# EasyEDA Pro project wireless charger controller.eprj, schematic Schematic3
Board Name: 3代; Create Date: 2025-03-22; Page Name: P1; Project Name: wireless charger controller; Schematic Name: Schematic3; Update Date: 2025-05-02; Company: 嘉立创EDA; Page Size: A4; Version: V1.0
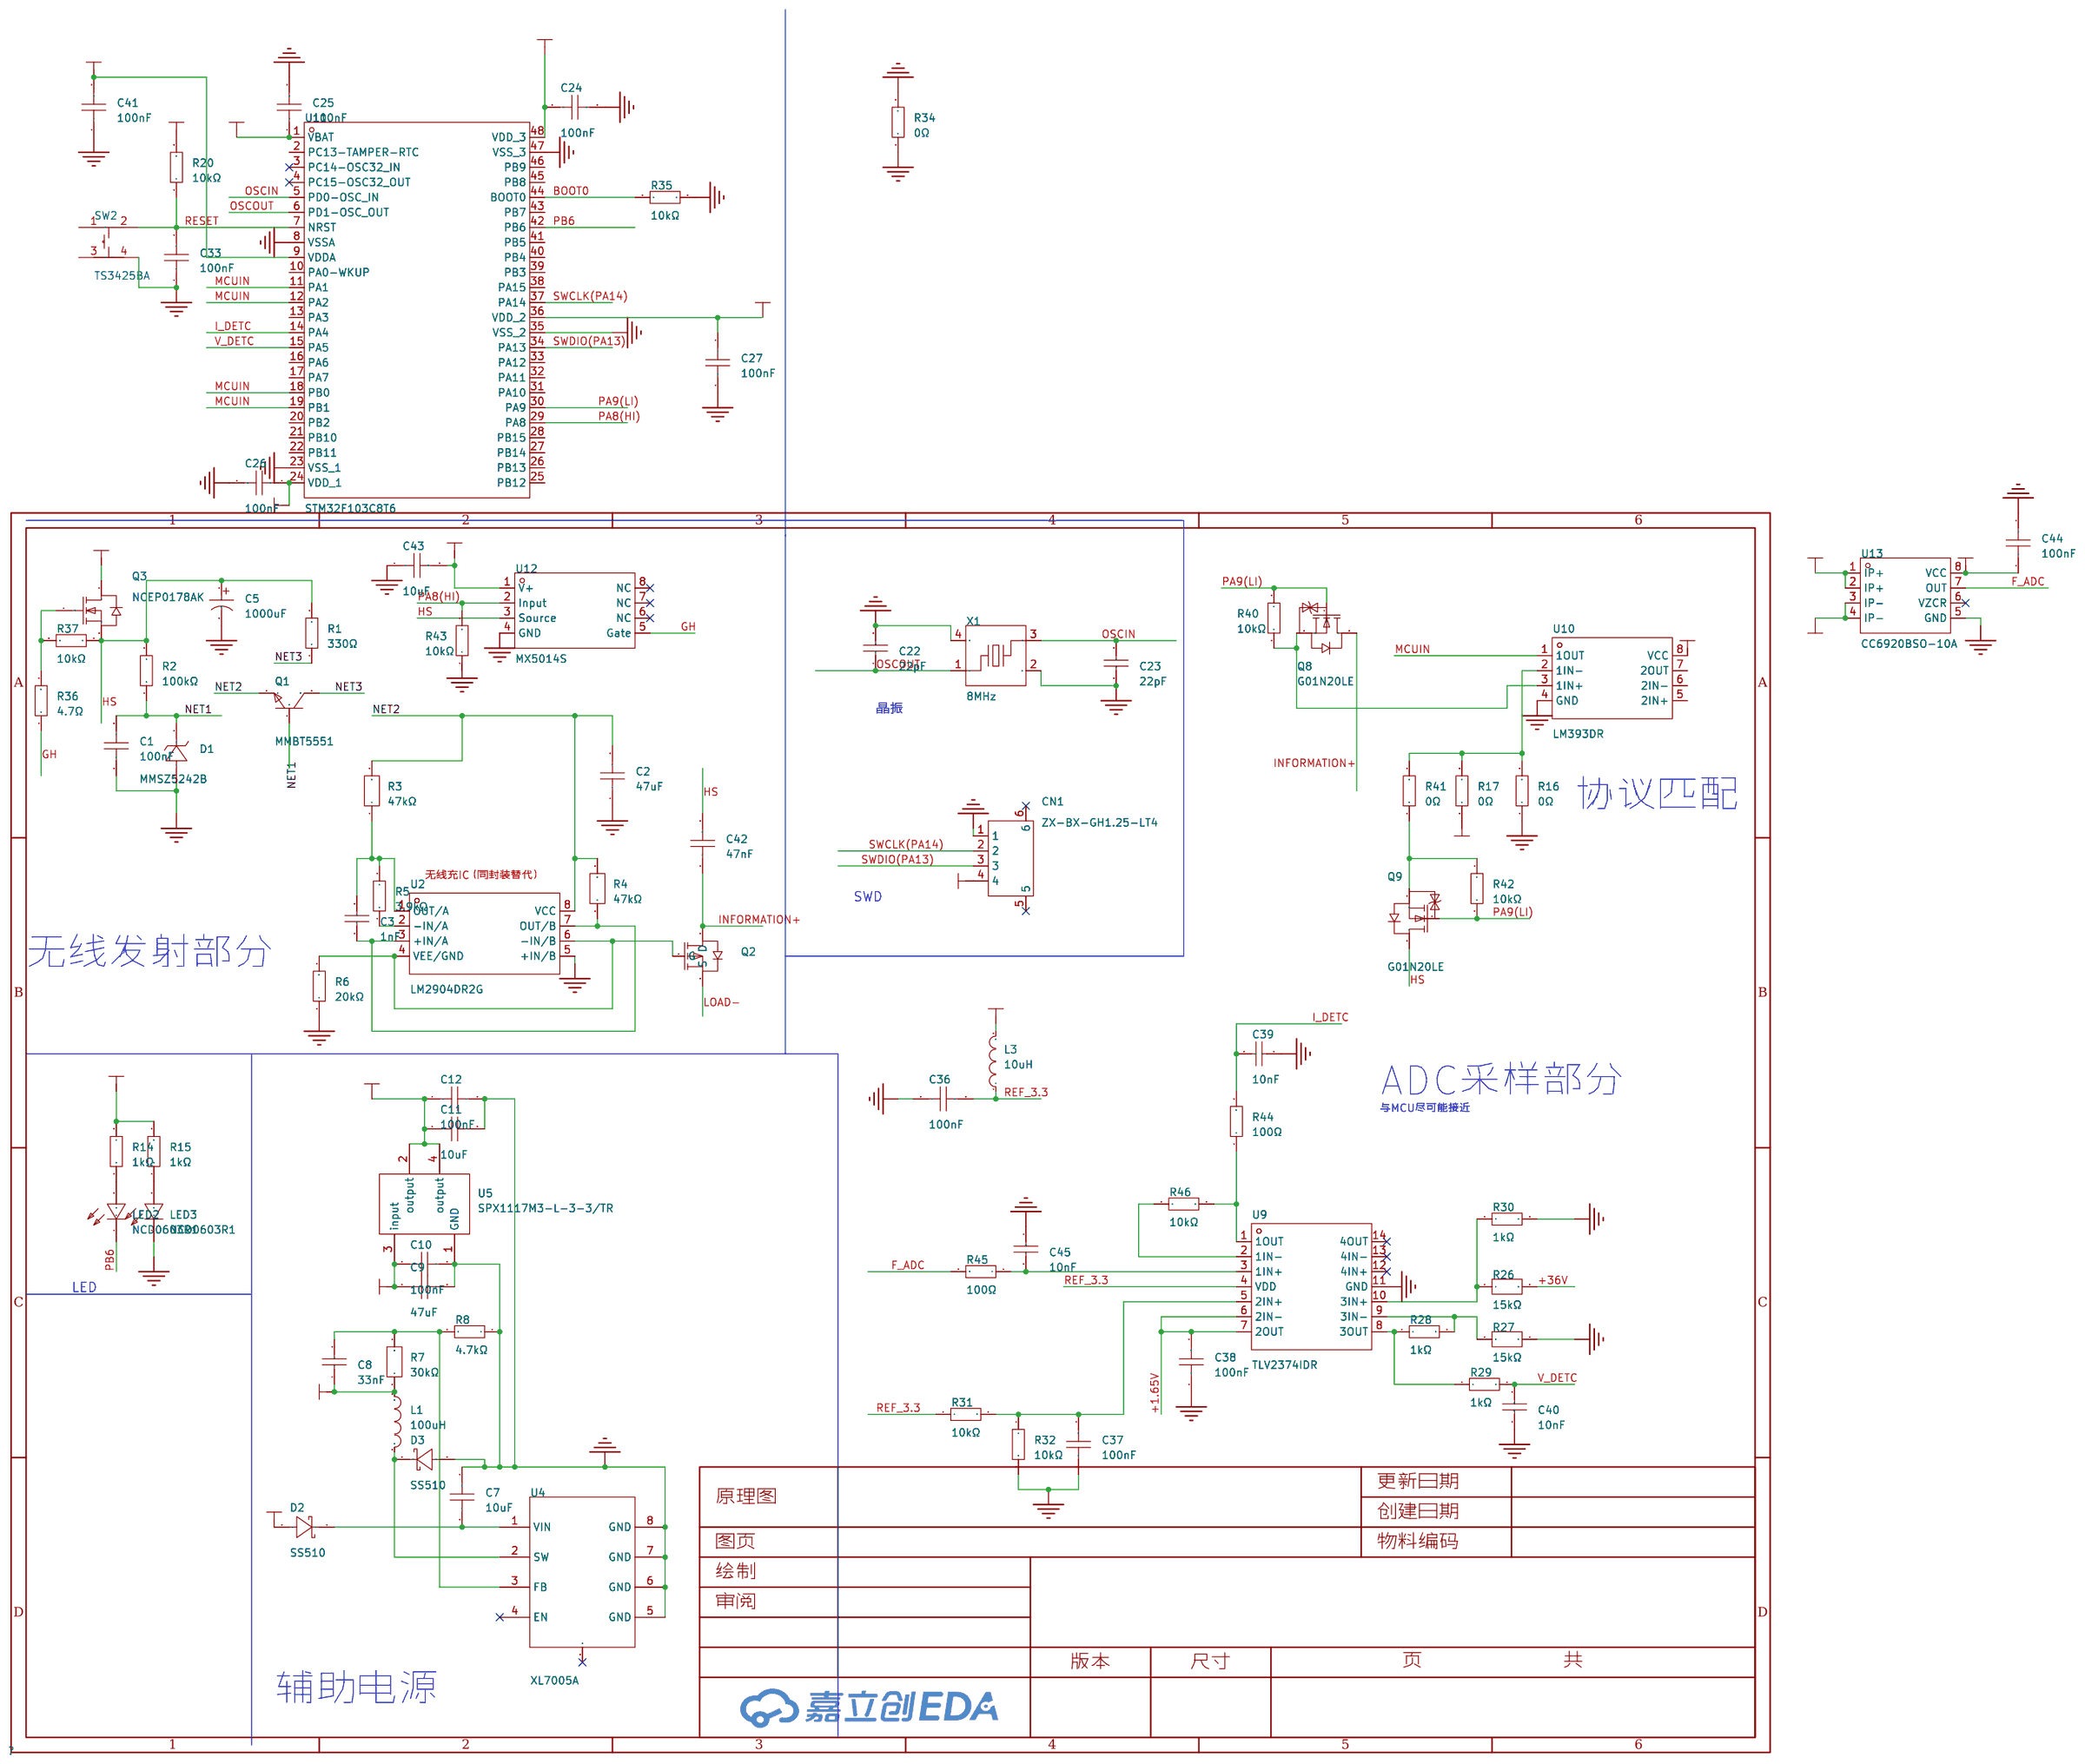
[diagram p1: schematic sheet]

## Parts
C1  100nF  [C0603]
C2  47uF  [C1206]
C3  1nF  [C0603]
C5  1000uF  [CAP-TH_BD13.0-P5.00-D1.2-FD]
C7  10uF  [C1206]
C8  33nF  [C0603]
C9  47uF  [C1206]
C10  100nF  [C0603]
C11  10uF  [C0603]
C12  100nF  [C0603]
C22  22pF  [C0603]
C23  22pF  [C0603]
C24  100nF  [C0603]
C25  100nF  [C0603]
C26  100nF  [C0603]
C27  100nF  [C0603]
C33  100nF  [C0603]
C36  100nF  [C0603]
C37  100nF  [C0603]
C38  100nF  [C0603]
C39  10nF  [C0603]
C40  10nF  [C0603]
C41  100nF  [C0603]
C42  47nF  [C1210]
C43  10uF  [C1206]
C44  100nF  [C0603]
C45  10nF  [C0603]
CN1  ZX-BX-GH1.25-LT4  [CONN-SMD_ZX-BX-GH1.25-LT4]
D1  MMSZ5242B  [SOD-123_L2.7-W1.6-LS3.7-RD]
D2  SS510  [SMA_L4.3-W2.6-LS5.0-RD]
D3  SS510  [SMA_L4.3-W2.6-LS5.0-RD]
L1  100uH  [IND-SMD_L6.0-W6.0_FNR60XXS]
L3  10uH  [L0603]
LED2  NCD0603R1  [LED0603-RD_RED]
LED3  NCD0603R1  [LED0603-RD_RED]
Q1  MMBT5551  [SOT-23-3_L2.9-W1.3-P1.90-LS2.4-BR]
Q2  -  [IRF9540P_TO-220]
Q3  NCEP0178AK  [TO-252-2_L6.5-W6.1-P4.58-LS10.0-TL]
Q8  G01N20LE  [SOT-23-3_L2.9-W1.6-P1.90-LS2.8-BR]
Q9  G01N20LE  [SOT-23-3_L2.9-W1.6-P1.90-LS2.8-BR]
R1  330Ω  [R0603]
R2  100kΩ  [R0603]
R3  47kΩ  [R0603]
R4  47kΩ  [R0603]
R5  3.9kΩ  [R0603]
R6  20kΩ  [R0603]
R7  30kΩ  [R0603]
R8  4.7kΩ  [R0603]
R14  1kΩ  [R0603]
R15  1kΩ  [R0603]
R16  0Ω  [R0603]
R17  0Ω  [R0603]
R20  10kΩ  [R0603]
R26  15kΩ  [R0603]
R27  15kΩ  [R0603]
R28  1kΩ  [R0603]
R29  1kΩ  [R0603]
R30  1kΩ  [R0603]
R31  10kΩ  [R0603]
R32  10kΩ  [R0603]
R34  0Ω  [R0603]
R35  10kΩ  [R0603]
R36  4.7Ω  [R0603]
R37  10kΩ  [R0603]
R40  10kΩ  [R0603]
R41  0Ω  [R0603]
R42  10kΩ  [R0603]
R43  10kΩ  [R0603]
R44  100Ω  [R0603]
R45  100Ω  [R0603]
R46  10kΩ  [R0603]
SW2  TS3425BA  [SW-SMD_4P-L4.2-W3.2-P2.15-LS4.6-1]
U2  LM2904DR2G  [SOIC-8_L4.9-W3.9-P1.27-LS6.0-BL]
U4  XL7005A  [SOIC-8_L4.9-W3.9-P1.27-LS6.0-BL-EP3.1-1]
U5  SPX1117M3-L-3-3/TR  [SOT-223-4_L6.5-W3.5-P2.30-LS7.0-BR]
U9  TLV2374IDR  [SOIC-14_L8.7-W3.9-P1.27-LS6.0-BL]
U10  LM393DR  [SOIC-8_L5.0-W4.0-P1.27-LS6.0-BL]
U11  STM32F103C8T6  [LQFP-48_L7.0-W7.0-P0.50-LS9.0-BL]
U12  MX5014S  [SOIC-8_L4.9-W3.9-P1.27-LS6.0-BL]
U13  CC6920BSO-10A  [SOP-8_L5.0-W4.0-P1.27-LS6.0-BL]
X1  8MHz  [CRYSTAL-SMD_4P-L3.2-W2.5-BL]

## Library data of the parts
C1 C10 C12 C24-C27 C33 C36-C38 C41 C44 = CGA0603X7R104K500JT: LCSC Part Name: 100nF ±10% 50V; Supplier Part: C6119867; Manufacturer: HRE(芯声); Supplier Footprint: 0603; JLCPCB Part Class: 扩展库; Supplier: LCSC; Tolerance: ±10%; Voltage Rated: 50V; Temperature Coefficient: X7R
C2 = HGC1206R5476M160NSPJ: LCSC Part Name: 47uF ±20% 16V; Supplier Part: C7472975; Manufacturer: Chinocera(华瓷); Supplier Footprint: 1206; JLCPCB Part Class: 扩展库; Datasheet: https://atta.szlcsc.com/upload/public/pdf/source/20240320/FAC3FEC40A78BC5CCCE96C232A94D860.pdf; Supplier: LCSC; Tolerance: ±20%; Voltage Rated: 16V; Temperature Coefficient: X5R
C3 = CC0603JRNPO9BN102: LCSC Part Name: 1nF ±5% 50V; Supplier Part: C106246; Manufacturer: YAGEO(国巨); Supplier Footprint: 0603; JLCPCB Part Class: 扩展库; Datasheet: https://atta.szlcsc.com/upload/public/pdf/source/20170505/1493957838062.pdf; Supplier: LCSC; Tolerance: ±5%; Voltage Rated: 50V; Temperature Coefficient: NP0
C5 = 35YXJ1000M12.5X20: LCSC Part Name: 1000uF ±20% 35V; Supplier Part: C88743; Manufacturer: rubycon(红宝石); Supplier Footprint: 插件,D12.5xL20mm; JLCPCB Part Class: 扩展库; Datasheet: https://atta.szlcsc.com/upload/public/pdf/source/20200113/C88743_7A9E1D91AFF2E9AFD34B160DBDD0EC66.pdf; Supplier: LCSC; Tolerance: ±20%; Rated Voltage: 35V; Lead Spacing: 5mm; φD: 12.5mm; L: 20mm; Lifetime @ Temp: 10000hrs@105℃
C7 C43 = HGC1206R5106K500NSPJ: LCSC Part Name: 10uF ±10% 50V; Supplier Part: C7432781; Manufacturer: Chinocera(华瓷); Supplier Footprint: 1206; JLCPCB Part Class: 扩展库; Datasheet: https://atta.szlcsc.com/upload/public/pdf/source/20240320/FAC3FEC40A78BC5CCCE96C232A94D860.pdf; Supplier: LCSC; Tolerance: ±10%; Voltage Rated: 50V; Temperature Coefficient: X5R
C8 = CL10B333KB8NNNC: LCSC Part Name: 33nF ±10% 50V; Supplier Part: C21117; Manufacturer: SAMSUNG(三星); Supplier Footprint: 0603; JLCPCB Part Class: 基础库; Datasheet: https://atta.szlcsc.com/upload/public/pdf/source/20160218/1457707763339.pdf; Supplier: LCSC; Tolerance: ±10%; Voltage Rated: 50V; Temperature Coefficient: X7R
C9 = HGC1206R5476M250NSPJ: LCSC Part Name: 47uF ±20% 25V; Supplier Part: C22367835; Manufacturer: Chinocera(华瓷); Supplier Footprint: 1206; JLCPCB Part Class: 扩展库; Datasheet: https://atta.szlcsc.com/upload/public/pdf/source/20240326/E6CB0DC43BB858B74F4352229FABFDCA.pdf; Supplier: LCSC; Tolerance: ±20%; Voltage Rated: 25V; Temperature Coefficient: X5R
C11 = CGA0603X5R106K100JT: LCSC Part Name: 10uF ±10% 10V; Supplier Part: C6119842; Manufacturer: HRE(芯声); Supplier Footprint: 0603; JLCPCB Part Class: 扩展库; Supplier: LCSC; Tolerance: ±10%; Voltage Rated: 10V; Temperature Coefficient: X5R
C22 C23 = CC0603JRNPO9BN220: LCSC Part Name: 22pF ±5% 50V; Supplier Part: C105620; Manufacturer: YAGEO(国巨); Supplier Footprint: 0603; JLCPCB Part Class: 扩展库; Datasheet: https://atta.szlcsc.com/upload/public/pdf/source/20170505/1493957838062.pdf; Supplier: LCSC; Tolerance: ±5%; Voltage Rated: 50V; Temperature Coefficient: NP0
C39 C40 C45 = CC0603KRX7R9BB103: LCSC Part Name: 10nF ±10% 50V; Supplier Part: C100042; Manufacturer: YAGEO(国巨); Supplier Footprint: 0603; JLCPCB Part Class: 扩展库; Datasheet: https://atta.szlcsc.com/upload/public/pdf/source/20181008/C309510_22F155564471FAF6A489F7D68F34234E.pdf; Supplier: LCSC; Tolerance: ±10%; Voltage Rated: 50V; Temperature Coefficient: X7R
C42 = FV32X473K102EGG: LCSC Part Name: 47nF ±10% 1kV; Supplier Part: C525361; Manufacturer: PSA(信昌电陶); Supplier Footprint: 1210; JLCPCB Part Class: 扩展库; Datasheet: https://atta.szlcsc.com/upload/public/pdf/source/20200506/C436246_4EAA78C9048D88437BAF2CB7B8BE45FD.pdf; Supplier: LCSC; Tolerance: ±10%; Voltage Rating: 1kV; Temperature Coefficient: X7R
CN1 = ZX-BX-GH1.25-LT4: LCSC Part Name: 1x4P 间距:1.25mm 立贴 系列:GH; Supplier Part: C7429508; Manufacturer: Megastar(兆星); Supplier Footprint: SMD,P=1.25mm; JLCPCB Part Class: 扩展库; Datasheet: https://atta.szlcsc.com/upload/public/pdf/source/20230619/3EA3860FAE766B302258B62130360A2E.pdf; Supplier: LCSC; Pins Structure: 1x4P; Pitch: 1.25mm; Mounting Type: 立贴; Reference Series: GH; Number of Pins: 4P; Number of Rows: 1; Number of PINs Per Row: 4; Contact Material: 磷铜; Contact Plating: 锡; Supplementary Features: 辅助焊脚; Color: 米色; Z-Height of the Board: 4.2mm; X-Length of Bottom Edge on Board (Spacing Line): 8.25mm; Y-Width of Bottom Edge on Board: 4.25mm
D1 = MMSZ5242B_C19077426: Supplier Part: C19077426; Manufacturer: 宏嘉诚; Supplier Footprint: SOD-123; JLCPCB Part Class: 扩展库; Datasheet: https://atta.szlcsc.com/upload/public/pdf/source/20250106/06B28F2C24D17E0AE22ECF6A1A26EDF7.pdf; Supplier: LCSC; Diode Configuration: 独立式; Zener Voltage(Nom): 12V; Reverse Leakage Current (Ir): 1uA@9.1V; Zener Voltage(Range): 11.4V~12.6V; Pd - Power Dissipation(Pd): 500mW; Impedance(Zzt): 30Ω
D2 D3 = SS510_C18199171: LCSC Part Name: 电压:100V 电流:5A; Supplier Part: C18199171; Manufacturer: 宏迦橙; Supplier Footprint: SMA(DO-214AC); JLCPCB Part Class: 扩展库; Datasheet: https://atta.szlcsc.com/upload/public/pdf/source/20230828/254C3882F8647358AD9F60DD73611B5E.pdf; Supplier: LCSC; Diode Configuration: 独立式; Forward Voltage (Vf@If): 850mV@5A; Reverse Voltage (Vr): 100V; Rectified Current: 5A; Reverse Leakage Current (Ir): 50uA@100V
L1 = FNR6045S101MT: LCSC Part Name: 100uH ±20% 1A; Supplier Part: C168095; Manufacturer: cjiang(长江微电); Supplier Footprint: SMD,6x6mm; JLCPCB Part Class: 扩展库; Datasheet: https://atta.szlcsc.com/upload/public/pdf/source/20190327/C167925_9EFF0AABC4CA629C2CC95961DBF7D39D.pdf; Supplier: LCSC; Tolerance: ±20%; Rated Current: 880mA; Saturation Current (Isat): 1A; DC Resistance (DCR): 563mΩ
L3 = LQM18FN100M00D: LCSC Part Name: 10uH ±20% 50mA; Supplier Part: C86083; Manufacturer: muRata(村田); Supplier Footprint: 0603; JLCPCB Part Class: 扩展库; Datasheet: https://atta.szlcsc.com/upload/public/pdf/source/20181211/C324471_E5AB673E56FAD8B75EB4C57DC23E4148.pdf; Supplier: LCSC; Tolerance: ±20%; Rated Current: 50mA; Saturation Current (Isat): 50mA; DC Resistance (DCR): 1.17Ω; Frequency - Self Resonant: 30MHz
LED2 LED3 = NCD0603R1_C84263: Supplier Part: C84263; Manufacturer: 国星光电; Supplier Footprint: 0603; JLCPCB Part Class: 扩展库; Datasheet: https://atta.szlcsc.com/upload/public/pdf/source/20200820/C84263_DABC6A75E58F576973B407FDBA283D60.pdf; Supplier: LCSC; Emitted Color: 红色; Forward Voltage (VF): 1.6V~2.6V; Power Dissipation: 65mW; Forward Current: 20mA; Dominant Wavelength: 615nm~630nm; Diode Configuration: 独立二极管; Lens Color: 无色透明透镜; Luminous Intensity: 80mcd~220mcd; Viewing Angle: 130°; Operating Temperature: -30℃~+85℃
Q1 = MMBT5551_C7420357: LCSC Part Name: hFE:100-300; Supplier Part: C7420357; Manufacturer: 宏迦橙; Supplier Footprint: SOT-23; JLCPCB Part Class: 扩展库; Datasheet: https://atta.szlcsc.com/upload/public/pdf/source/20231222/D38E1B30E95EC4C2952AC0E289834E8E.pdf; Supplier: LCSC; Transistor Type: NPN; Collector Current (Ic): 600mA; Collector-Emitter Breakdown Voltage (Vceo): 160V; Power Dissipation (Pd): 300mW; DC Current Gain (hFE@Ic,Vce): 100@10mA,5.0V; Transition Frequency (fT): 100MHz; Collector Cut-Off Current (Icbo): 50nA; Collector-Emitter Saturation Voltage (VCE(sat)@Ic,Ib): 150mV@10mA,1.0mA; Operating Temperature: -55℃~+150℃
Q2 = IRF9540_P: Supplier Footprint: TO-220-3
Q3 = NCEP0178AK: LCSC Part Name: 1个N沟道 耐压:100V 电流:78A; Supplier Part: C216784; Manufacturer: NCE(无锡新洁能); Supplier Footprint: TO-252-2(DPAK); JLCPCB Part Class: 扩展库; Datasheet: https://atta.szlcsc.com/upload/public/pdf/source/20180614/C216784_4CC9571F208305EE00914CFFBA9F145C.pdf; Supplier: LCSC; Type: 1个N沟道; Drain to Source Voltage: 100V; Current - Continuous Drain(Id): 78A; RDS(on): 9.5mΩ@4.5V,39A; Pd - Power Dissipation: 125W; Gate Threshold Voltage (Vgs(th)@Id): 1.2V; Gate Charge(Qg): 65nC@50V; Input Capacitance(Ciss@Vds): 5.48nF@50V; Reverse Transfer Capacitance (Crss@Vds): 30pF@50V; Operating Temperature: -55℃~+175℃
Q8 Q9 = G01N20LE: LCSC Part Name: N沟道增强型功率MOSFET,电流:1.7A,耐压:200V; Supplier Part: C2840756; Manufacturer: GOFORD(谷峰); Supplier Footprint: SOT-23-3L; JLCPCB Part Class: 扩展库; Datasheet: https://www.gofordsemi.com/upload/cn/propdf/G01N20LE.pdf; Supplier: LCSC; Type: 1个N沟道; Drain Source Voltage (Vdss): 200V; Continuous Drain Current (Id): 1.7A; Drain Source On Resistance (RDS(on)@Vgs,Id): 850mΩ@10V,1.7A; Power Dissipation (Pd): 1.5W; Gate Threshold Voltage (Vgs(th)@Id): 2.5V@250uA; Total Gate Charge (Qg@Vgs): 12nC@100V; Input Capacitance (Ciss@Vds): 580pF; Reverse Transfer Capacitance (Crss@Vds): 30pF@25V; Operating Temperature: -55℃~+150℃
R1 = 0603WAF3300T5E: LCSC Part Name: 330Ω ±1% 100mW 厚膜电阻; Supplier Part: C23138; Manufacturer: UNI-ROYAL(厚声); Supplier Footprint: 0603; JLCPCB Part Class: 基础库; Datasheet: https://atta.szlcsc.com/upload/public/pdf/source/20200306/C422600_1E6D84923E4A46A82E41ADD87F860B5C.pdf; Supplier: LCSC; Type: 厚膜电阻; Tolerance: ±1%; Power(Watts): 100mW; Overload Voltage (Max): 75V; Temperature Coefficient: ±100ppm/℃; Operating Temperature Range: -55℃~+155℃
R2 = 0603WAF1003T5E: LCSC Part Name: 100kΩ ±1% 100mW 厚膜电阻; Supplier Part: C25803; Manufacturer: UNI-ROYAL(厚声); Supplier Footprint: 0603; JLCPCB Part Class: 基础库; Datasheet: https://atta.szlcsc.com/upload/public/pdf/source/20200306/C422600_1E6D84923E4A46A82E41ADD87F860B5C.pdf; Supplier: LCSC; Type: 厚膜电阻; Tolerance: ±1%; Power(Watts): 100mW; Overload Voltage (Max): 75V; Temperature Coefficient: ±100ppm/℃; Operating Temperature Range: -55℃~+155℃
R3 R4 = FRC0603F4702TS: LCSC Part Name: 47kΩ ±1% 100mW 厚膜电阻; Supplier Part: C2907042; Manufacturer: FOJAN(富捷); Supplier Footprint: 0603; JLCPCB Part Class: 扩展库; Datasheet: https://atta.szlcsc.com/upload/public/pdf/source/20211221/925EC7D7225764EE0046F22065062C87.pdf; Supplier: LCSC; Type: 厚膜电阻; Tolerance: ±1%; Power(Watts): 100mW; Overload Voltage (Max): 75V; Temperature Coefficient: ±100ppm/℃; Operating Temperature Range: -55℃~+155℃
R5 = 0603WAF3901T5E: LCSC Part Name: 3.9kΩ ±1% 100mW 厚膜电阻; Supplier Part: C23018; Manufacturer: UNI-ROYAL(厚声); Supplier Footprint: 0603; JLCPCB Part Class: 基础库; Datasheet: https://atta.szlcsc.com/upload/public/pdf/source/20200306/C422600_1E6D84923E4A46A82E41ADD87F860B5C.pdf; Supplier: LCSC; Type: 厚膜电阻; Tolerance: ±1%; Power(Watts): 100mW; Overload Voltage (Max): 75V; Temperature Coefficient: ±100ppm/℃; Operating Temperature Range: -55℃~+155℃
R6 = 0603WAF2002T5E: LCSC Part Name: 20kΩ ±1% 100mW 厚膜电阻; Supplier Part: C4184; Manufacturer: UNI-ROYAL(厚声); Supplier Footprint: 0603; JLCPCB Part Class: 基础库; Datasheet: https://atta.szlcsc.com/upload/public/pdf/source/20200306/C422600_1E6D84923E4A46A82E41ADD87F860B5C.pdf; Supplier: LCSC; Type: 厚膜电阻; Tolerance: ±1%; Power(Watts): 100mW; Overload Voltage (Max): 75V; Temperature Coefficient: ±100ppm/℃; Operating Temperature Range: -55℃~+155℃
R7 = FRC0603F3002TS: LCSC Part Name: 30kΩ ±1% 100mW 厚膜电阻; Supplier Part: C2907025; Manufacturer: FOJAN(富捷); Supplier Footprint: 0603; JLCPCB Part Class: 扩展库; Datasheet: https://atta.szlcsc.com/upload/public/pdf/source/20211221/925EC7D7225764EE0046F22065062C87.pdf; Supplier: LCSC; Type: 厚膜电阻; Tolerance: ±1%; Power(Watts): 100mW; Overload Voltage (Max): 75V; Temperature Coefficient: ±100ppm/℃; Operating Temperature Range: -55℃~+155℃
R8 = 0603WAF4701T5E: LCSC Part Name: 4.7kΩ ±1% 100mW 厚膜电阻; Supplier Part: C23162; Manufacturer: UNI-ROYAL(厚声); Supplier Footprint: 0603; JLCPCB Part Class: 基础库; Datasheet: https://atta.szlcsc.com/upload/public/pdf/source/20200306/C422600_1E6D84923E4A46A82E41ADD87F860B5C.pdf; Supplier: LCSC; Type: 厚膜电阻; Tolerance: ±1%; Power(Watts): 100mW; Overload Voltage (Max): 75V; Temperature Coefficient: ±100ppm/℃; Operating Temperature Range: -55℃~+155℃
R14 R15 R28-R30 = 0603WAF1001T5E: LCSC Part Name: 1kΩ ±1% 100mW 厚膜电阻; Supplier Part: C21190; Manufacturer: UNI-ROYAL(厚声); Supplier Footprint: 0603; JLCPCB Part Class: 基础库; Datasheet: https://atta.szlcsc.com/upload/public/pdf/source/20200306/C422600_1E6D84923E4A46A82E41ADD87F860B5C.pdf; Supplier: LCSC; Type: 厚膜电阻; Tolerance: ±1%; Power(Watts): 100mW; Overload Voltage (Max): 75V; Temperature Coefficient: ±100ppm/℃; Operating Temperature Range: -55℃~+155℃
R16 R17 R34 R41 = 0603WAF0000T5E: LCSC Part Name: 0Ω ±1% 100mW 厚膜电阻; Supplier Part: C21189; Manufacturer: UNI-ROYAL(厚声); Supplier Footprint: 0603; JLCPCB Part Class: 基础库; Datasheet: https://atta.szlcsc.com/upload/public/pdf/source/20200306/C422600_1E6D84923E4A46A82E41ADD87F860B5C.pdf; Supplier: LCSC; Type: 厚膜电阻; Tolerance: ±1%; Power(Watts): 100mW; Overload Voltage (Max): 75V; Operating Temperature Range: -55℃~+155℃
R20 R31 R32 R35 R37 R40 R42 R43 R46 = 0603WAF1002T5E: LCSC Part Name: 厚膜电阻 10kΩ ±1% 100mW; Supplier Part: C25804; Manufacturer: UNI-ROYAL(厚声); Supplier Footprint: 0603; JLCPCB Part Class: Basic Part; Datasheet: https://atta.szlcsc.com/upload/public/pdf/source/20200306/C422600_1E6D84923E4A46A82E41ADD87F860B5C.pdf; Supplier: LCSC; Type: 厚膜电阻; Tolerance: ±1%; Power(Watts): 100mW; Overload Voltage (Max): 75V; Temperature Coefficient: ±100ppm/℃; Operating Temperature Range: -55℃~+155℃
R26 R27 = FRC0603F1502TS: LCSC Part Name: 15kΩ ±1% 100mW 厚膜电阻; Supplier Part: C2906995; Manufacturer: FOJAN(富捷); Supplier Footprint: 0603; JLCPCB Part Class: 扩展库; Datasheet: https://atta.szlcsc.com/upload/public/pdf/source/20211221/925EC7D7225764EE0046F22065062C87.pdf; Supplier: LCSC; Type: 厚膜电阻; Tolerance: ±1%; Power(Watts): 100mW; Overload Voltage (Max): 75V; Temperature Coefficient: ±100ppm/℃; Operating Temperature Range: -55℃~+155℃
R36 = 0603WAF470KT5E: LCSC Part Name: 4.7Ω ±1% 100mW 厚膜电阻; Supplier Part: C23164; Manufacturer: UNI-ROYAL(厚声); Supplier Footprint: 0603; JLCPCB Part Class: 基础库; Datasheet: https://atta.szlcsc.com/upload/public/pdf/source/20200306/C422600_1E6D84923E4A46A82E41ADD87F860B5C.pdf; Supplier: LCSC; Type: 厚膜电阻; Tolerance: ±1%; Power(Watts): 100mW; Overload Voltage (Max): 75V; Temperature Coefficient: ±400ppm/℃; Operating Temperature Range: -55℃~+155℃
R44 R45 = 0603WAF1000T5E: LCSC Part Name: 100Ω ±1% 100mW 厚膜电阻; Supplier Part: C22775; Manufacturer: UNI-ROYAL(厚声); Supplier Footprint: 0603; JLCPCB Part Class: 基础库; Datasheet: https://atta.szlcsc.com/upload/public/pdf/source/20200306/C422600_1E6D84923E4A46A82E41ADD87F860B5C.pdf; Supplier: LCSC; Type: 厚膜电阻; Tolerance: ±1%; Power(Watts): 100mW; Overload Voltage (Max): 75V; Temperature Coefficient: ±200ppm/℃; Operating Temperature Range: -55℃~+155℃
SW2 = TS3425BA: LCSC Part Name: 4.2*3.2*2.5mm 立贴 轻触开关; Supplier Part: C2681476; Manufacturer: SHOU HAN(首韩); Supplier Footprint: SMD; JLCPCB Part Class: 扩展库; Datasheet: https://atta.szlcsc.com/upload/public/pdf/source/20210107/C2681476_BF217B2301F0070AA49504CB0BFDE895.pdf; Supplier: LCSC; Circuit: 单刀单掷; Actuator Style: 椭圆形按钮; Operating Force: 250gf; Mounting Style: 立贴; Switch Length: 4.2mm; Switch Width: 3.2mm; Switch Height: 2.5mm; Strike Gundam: 不带; Contact Current: 50mA; Voltage Rating (DC): 12V; Insulation Resistance: 100MΩ; Actuator/Cap Color: 白色; Pin Style: J型引脚; Mechanical Life: 10万次; Operating Temperature: -20℃~+85℃
U2 = LM2904DR2G: Supplier Part: C18229; Manufacturer: onsemi(安森美); Supplier Footprint: SOIC-8; JLCPCB Part Class: 扩展库; Datasheet: https://atta.szlcsc.com/upload/public/pdf/source/20241203/BA383AB6F92C1D3D0DD6D262792E2276.pdf; Supplier: LCSC; Number of Circuits: 双路; Maximum Power Supply Range (Vdd-Vss): 32V; Gain Bandwidth Product(GBP): 1MHz; Voltage - Input Offset(Vos): 7mV; Input Offset Voltage Drift (Vos TC): 7uV/℃; Current - Input Bias(Ib): 45nA; Common Mode Rejection Ratio (CMRR): 70dB; Quiescent Current: 1.5mA; Output Current: 40mA; Operating Temperature: -40℃~+85℃
U4 = XL7005A: LCSC Part Name: 0.4A 150kHz 80V 降压型DC-DC转换器; Supplier Part: C50848; Manufacturer: XLSEMI(芯龙); Supplier Footprint: SOIC-8-EP; JLCPCB Part Class: 扩展库; Datasheet: https://atta.szlcsc.com/upload/public/pdf/source/20150821/1457707346919.pdf; Supplier: LCSC; Function: 降压型; Output Type: 可调; Input Voltage: 5V~80V; Output Voltage: 1.25V~20V; Output Current: 400mA; Switching Frequency: 150kHz; Operating Temperature: -40℃~+125℃; Number of Outputs: 1; Topology: 降压式
U5 = SPX1117M3-L-3-3/TR: Supplier Part: C6862; Manufacturer: MaxLinear(迈凌); Supplier Footprint: SOT-223; JLCPCB Part Class: 扩展库; Datasheet: https://atta.szlcsc.com/upload/public/pdf/source/20161024/1477287964949.pdf; Supplier: LCSC; Output Type: 固定; Maximum Input Voltage: 20V; Output Voltage: 3.3V; MAX Output Current: 800mA; Power Supply Rejection Ratio (PSRR): 70dB@(120Hz); Dropout Voltage: 1.3V@(800mA); standby current: 10mA; Operating Temperature: -40℃~+125℃; Output Polarity: 正极; Number of Outputs: 1
U9 = TLV2374IDR: Supplier Part: C29793; Manufacturer: TI(德州仪器); Supplier Footprint: SOIC-14-150mil; JLCPCB Part Class: 扩展库; Datasheet: https://www.ti.com/cn/lit/gpn/tlv2374; Supplier: LCSC; Number of Circuits: 四路; Gain Bandwidth Product(GBP): 3MHz; Current - Input Bias(Ib): 1pA; Slew Rate(SR): 2.1V/us; Output Current: 16mA; Supply Current: 750uA; Operating Temperature: -40℃~+125℃
U10 = LM393DR: Supplier Part: C67470; Manufacturer: TI(德州仪器); Supplier Footprint: SOIC-8; JLCPCB Part Class: 扩展库; Datasheet: https://www.ti.com/cn/lit/gpn/lm393; Supplier: LCSC; Input Offset Voltage (Vos): 5mV; Input Bias Current (Ib): 250nA; Supply Voltage: 1V~18V；2V~36V; Output Type: 开集; Supply Current: 2.5mA; Operating Temperature: 0℃~+70℃
U11 = STM32F103C8T6: LCSC Part Name: 主流增强型ARM Cortex-M3 MCU，具有64 KB Flash、72 MHz CPU、电机控制、USB和CAN; Supplier Part: C8734; Manufacturer: ST(意法半导体); Supplier Footprint: LQFP-48(7x7); JLCPCB Part Class: 扩展库; Datasheet: https://atta.szlcsc.com/upload/public/pdf/source/20220812/8363ACEC51AD55ECEB84799464F7CB85.pdf; Supplier: LCSC; CPU Core: ARM-M3; CPU Maximum Speed: 72MHz; Program Storage Size: 64KB; Program Memory Type: FLASH; Number of I/O: 37; ADC (Bit): 12bit; Low Voltage Detection Threshold: 2V~3.6V
U12 = MX5014S: LCSC Part Name: 高边驱动; Supplier Part: C5359091; Manufacturer: Wuxi Maxinmicro(无锡明芯微); Supplier Footprint: SOP-8L; JLCPCB Part Class: 扩展库; Datasheet: https://atta.szlcsc.com/upload/public/pdf/source/20230209/33EE770FFA27735255664B6163A2CBF6.pdf; Supplier: LCSC; Driven Configuration: 高边
U13 = CC6920BSO-10A: Supplier Part: C2880431; Manufacturer: CrossChip(成都芯进); Supplier Footprint: SOP-8; JLCPCB Part Class: 扩展库; Datasheet: https://atta.szlcsc.com/upload/public/pdf/source/20241128/C0E6ECA7AE7321445B7BA60B45AD2C20.pdf; Supplier: LCSC; Current Range: -10A~10A; Supply Voltage: 3.3V; Isolated Voltage Withstand: 3500Vrms; Sensitivity: 132mV/A; Standby Current: 20mA; Operating Temperature: -40℃~+125℃
X1 = X32258MOB4SI: LCSC Part Name: 8MHz ±10ppm 12pF; Supplier Part: C2682775; Manufacturer: YXC(扬兴晶振); Supplier Footprint: SMD3225-4P; JLCPCB Part Class: 扩展库; Datasheet: https://atta.szlcsc.com/upload/public/pdf/source/20240329/19D5F850207469550BEB00D7DFEDBC7A.pdf; Supplier: LCSC; Type: 贴片晶振; Normal temperature Frequency Tolerance: ±10ppm; Load Capacitance: 12pF; Frequency Stability: ±20ppm; Equivalent Series Resistance(ESR): 150Ω; Operating Temperature: -40℃~+85℃

## Nets
36V: C43.2 D2.2(A) Q3.4(D) U12.1(V+) U13.3(IP-) U13.4(IP-)
+1.65V: C38.2 R17.1 U9.6(2IN-) U9.7(2OUT)
+3.3V: C11.1 C12.1 C24.1 C25.1 C26.1 C27.1 C41.2 C44.1 CN1.4 L3.2 R14.2 R15.2 R20.2 U5.2(output) U5.4(output) U10.8(VCC) U11.1(VBAT) U11.9(VDDA) U11.24(VDD_1) U11.36(VDD_2) U11.48(VDD_3) U13.8(VCC)
+9.5V: C8.1 C9.1 C10.1 L1.1 R7.1 U5.3(input)
+36V: R26.2 U13.1(IP+) U13.2(IP+)
GND: C22.2 C23.1 C24.2 C25.2 C26.2 C27.2 C33.1 C36.1 C37.1 C38.1 C39.1 C40.2 C41.1 C43.1 C45.1 CN1.1 LED3.1(K) R16.1 R27.2 R30.2 R32.2 R34.1 R35.2 R43.1 SW2.4 U9.11(GND) U10.4(GND) U11.8(VSSA) U11.23(VSS_1) U11.35(VSS_2) U11.47(VSS_3) U12.4(GND) X1.2(GND) X1.4(GND)
BOOT0: R35.1 U11.44(BOOT0)
F_ADC: R45.2 U13.7(OUT)
GH: R36.1 U12.5(Gate)
HS: C5.1 C42.2 Q3.3(S) Q9.3(D) R1.2 R2.2 R37.1 U12.3(Source)
I_DETC: C39.2 R44.2 U11.14(PA4)
INFORMATION+: C42.1 Q2.2(D) Q8.3(D)
LOAD-: Q2.3(S)
MCUIN: U10.1(1OUT) U11.11(PA1) U11.12(PA2) U11.18(PB0) U11.19(PB1)
NET1: C1.2 D1.1(K) Q1.1(B) R2.1
NET2: C2.2 Q1.2(E) R3.2 R4.2 U2.8(VCC)
NET3: Q1.3(C) R1.1
OSCIN: C23.2 U11.5(PD0-OSC_IN) X1.3
OSCOUT: C22.1 U11.6(PD1-OSC_OUT) X1.1
PA8(HI): R43.2 U11.29(PA8) U12.2(Input)
PA9(LI): Q8.1(G) Q9.1(G) R40.2 R42.2 U11.30(PA9)
PB6: LED2.1(K) U11.42(PB6)
REF_3.3: C36.2 L3.1 R31.1 U9.4(VDD)
RESET: C33.2 R20.1 SW2.2 U11.7(NRST)
SWCLK(PA14): CN1.2 U11.37(PA14)
SWDIO(PA13): CN1.3 U11.34(PA13)
V_DETC: C40.1 R29.2 U11.15(PA5)
WGND: C1.1 C2.1 C5.2 C7.1 C9.2 C10.2 C11.2 C12.2 C44.2 D1.2(A) D3.2(A) R6.1 R8.1 R34.2 U2.5(+IN/B) U4.5(GND) U4.6(GND) U4.7(GND) U4.8(GND) U5.1(GND) U13.5(GND)
$1N6946: C3.1 R4.1 U2.3(+IN/A) U2.7(OUT/B)
$1N6947: C3.2 R3.1 R5.2 U2.1(OUT/A)
$1N6948: R5.1 U2.2(-IN/A)
$1N6979: LED3.2(A) R15.1
$1N7002: C7.2 D2.1(K) U4.1(VIN)
$1N7004: D3.1(K) L1.2 U4.2(SW)
$1N7036: R16.2 R17.2 R41.2 U10.2(1IN-)
$1N7060: LED2.2(A) R14.1
$1N7082: Q8.2(S) R40.1 U10.3(1IN+)
$1N8055: C37.2 R31.2 R32.1 U9.5(2IN+)
$1N8063: C45.2 R45.1 U9.3(1IN+)
$1N8064: R44.1 R46.2 U9.1(1OUT)
$1N8072: R27.1 R28.2 U9.9(3IN-)
$1N8073: R26.1 R30.1 U9.10(3IN+)
$1N8078: R28.1 R29.1 U9.8(3OUT)
$1N17627: C8.2 R7.2 R8.2 U4.3(FB)
$1N22600: Q2.1(G) R6.2 U2.4(VEE/GND) U2.6(-IN/B)
$1N27675: Q3.1(G) R36.2 R37.2
$1N45503: Q9.2(S) R41.1 R42.1
$1N55790: R46.1 U9.2(1IN-)

Not connected (* = marked no-connect by the designer): CN1 5* 6*; SW2 1 3; U4 4(EN)* 9*; U9 12(4IN+)* 13(4IN-)* 14(4OUT)*; U10 5(2IN+) 6(2IN-) 7(2OUT); U11 2(PC13-TAMPER-RTC) 3(PC14-OSC32_IN)* 4(PC15-OSC32_OUT)* 10(PA0-WKUP) 13(PA3) 16(PA6) 17(PA7) 20(PB2) 21(PB10) 22(PB11) 25(PB12) 26(PB13) 27(PB14) 28(PB15) 31(PA10) 32(PA11) 33(PA12) 38(PA15) 39(PB3) 40(PB4) 41(PB5) 43(PB7) 45(PB8) 46(PB9); U12 6(NC)* 7(NC)* 8(NC)*; U13 6(VZCR)*

## Notes on the sheet
- 晶振
- 协议匹配
- 无线充IC（同封装替代）
- SWD
- 无线发射部分
- ADC采样部分
- 与MCU尽可能接近
- LED
- 辅助电源
